# Altium schematic sheet Mach cau H - Phuc.SchDoc: Mach Cau H
size A4; Organization: Altium Limited; Address1: L3, 12a Rodborough Rd; Address2: Frenchs Forest; Address3: NSW; Address4: Australia 2086
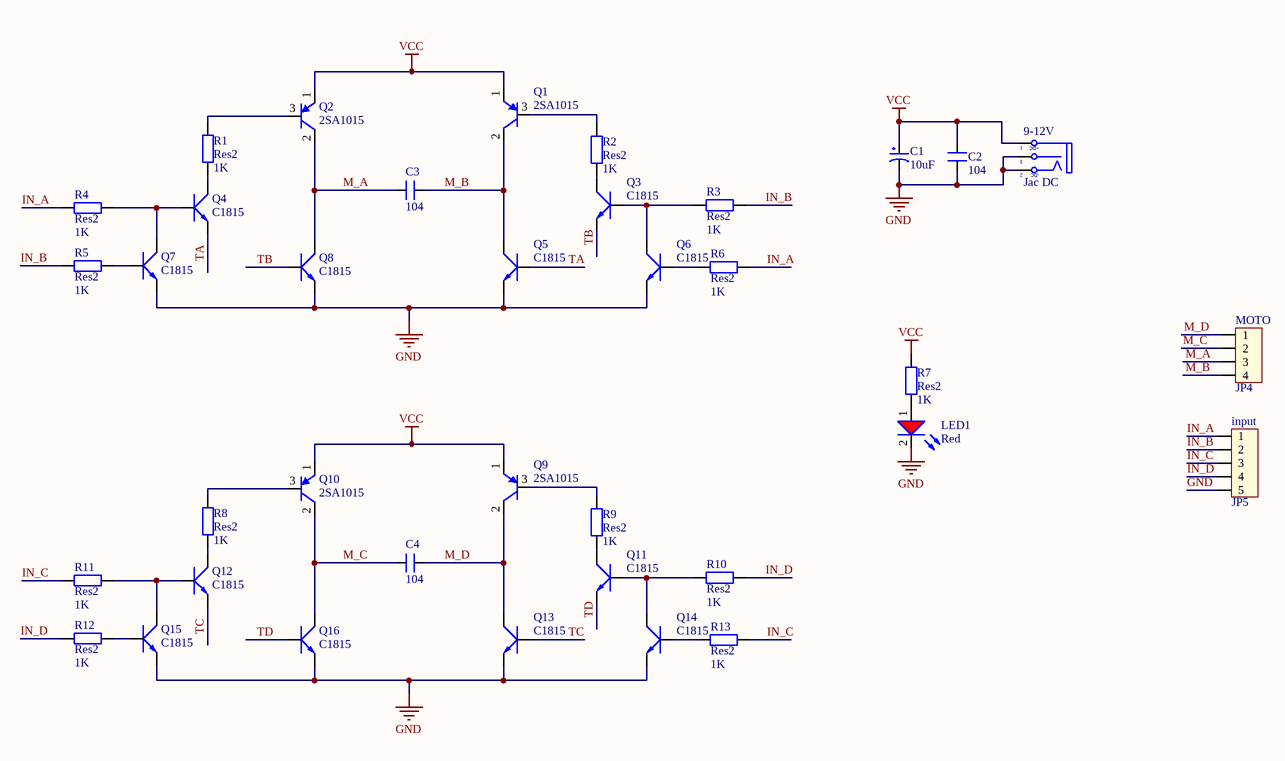
[diagram p0: Mach cau H - Phuc.SchDoc]

## Parts
9-12V  Jac DC  [DC-IN]
C1  10uF  [CP1/2]
C2  104  [CN2]
C3  104  [CN2]
C4  104  [CN2]
input  JP5  [JP5]
LED1  value Red  [LED3R]  (hidden comment: LT0668)
MOTO  JP4  [DOMINO-MKDS-4-PIN]
Q1  2SA1015  [QTO-220]
Q2  2SA1015  [QTO-220]
Q3  C1815  [QTO-92]
Q4  C1815  [QTO-92]
Q5  C1815  [QTO-220]
Q6  C1815  [QTO-92]
Q7  C1815  [QTO-92]
Q8  C1815  [QTO-220]
Q9  2SA1015  [QTO-220]
Q10  2SA1015  [QTO-220]
Q11  C1815  [QTO-92]
Q12  C1815  [QTO-92]
Q13  C1815  [QTO-220]
Q14  C1815  [QTO-92]
Q15  C1815  [QTO-92]
Q16  C1815  [QTO-220]
R1  Res2  value 1K  [RES 1/4W CFR25]
R2  Res2  value 1K  [RES 1/4W CFR25]
R3  Res2  value 1K  [RES 1/4W CFR25]
R4  Res2  value 1K  [RES 1/4W CFR25]
R5  Res2  value 1K  [RES 1/4W CFR25]
R6  Res2  value 1K  [RES 1/4W CFR25]
R7  Res2  value 1K  [RES 1/4W CFR25]
R8  Res2  value 1K  [RES 1/4W CFR25]
R9  Res2  value 1K  [RES 1/4W CFR25]
R10  Res2  value 1K  [RES 1/4W CFR25]
R11  Res2  value 1K  [RES 1/4W CFR25]
R12  Res2  value 1K  [RES 1/4W CFR25]
R13  Res2  value 1K  [RES 1/4W CFR25]

## Nets
GND: 9-12V.2(TN) 9-12V.3(S) C1.2 C2.1 input.5 LED1.2(K) Q5.1(E) Q6.1(E) Q7.1(E) Q8.1(E) Q13.1(E) Q14.1(E) Q15.1(E) Q16.1(E)
VCC: 9-12V.1(T) C1.1 C2.2 Q1.1(E) Q2.1(E) Q9.1(E) Q10.1(E) R7.2
IN_A: input.1 R4.2 R6.2
IN_B: input.2 R3.2 R5.1
IN_C: input.3 R11.2 R13.2
IN_D: input.4 R10.2 R12.1
M_A: C3.1 MOTO.3 Q2.2(C) Q8.2(C)
M_B: C3.2 MOTO.4 Q1.2(C) Q5.2(C)
M_C: C4.1 MOTO.2 Q10.2(C) Q16.2(C)
M_D: C4.2 MOTO.1 Q9.2(C) Q13.2(C)
TA: Q4.1(E) Q5.3(B)
TB: Q3.1(E) Q8.3(B)
TC: Q12.1(E) Q13.3(B)
TD: Q11.1(E) Q16.3(B)
NetLED1_1: LED1.1(A) R7.1
NetQ1_3: Q1.3(B) R2.2
NetQ2_3: Q2.3(B) R1.2
NetQ3_2: Q3.2(C) R2.1
NetQ3_3: Q3.3(B) Q6.2(C) R3.1
NetQ4_2: Q4.2(C) R1.1
NetQ4_3: Q4.3(B) Q7.2(C) R4.1
NetQ6_3: Q6.3(B) R6.1
NetQ7_3: Q7.3(B) R5.2
NetQ9_3: Q9.3(B) R9.2
NetQ10_3: Q10.3(B) R8.2
NetQ11_2: Q11.2(C) R9.1
NetQ11_3: Q11.3(B) Q14.2(C) R10.1
NetQ12_2: Q12.2(C) R8.1
NetQ12_3: Q12.3(B) Q15.2(C) R11.1
NetQ14_3: Q14.3(B) R13.1
NetQ15_3: Q15.3(B) R12.2

## Notes on the sheet
- Title
- Size:
- Date:
- A4
- Number:
- Time:
- Revision:
- Sheet
- of
- File:
- (in symbol DCIN) +DC; -DC

## Library data of the parts
9-12V = DCIN: Jac DC input; Value: Jac DC
C1 = CP1: Cap P  0,1uF < 22uF , 16 - 50V; Value: 10uF/50V; Description 1: 10 => 220uF/6,3V/10V - 10uF => 100uF/16V; Description 2: 0,1uF => 33uF/50V - 10uF => 22uF/63V; Description 3: 0,47uF => 10uF/100V
C2-C4 = CN2: Cap np 104 => 105pF; Value: 0.1uF
input = Con5: Connector 5; Value: Connector 5
LED1 = LT0668: LED Red 2mA 2.0V 3mm; ComponentLink1Description: Datasheet; ComponentLink1URL: D:\Dropbox\Datasheets\Opto and Illumination\LEDs\LT0668.pdf; Unit Price: 0.0067
MOTO = Con4: Connector 4; Value: Connector 4
Q1 Q2 Q9 Q10 = 2SA1015: Trans PNP -50V -150mA TO-92; ComponentLink1Description: Datasheet; ComponentLink1URL: D:\Dropbox\Datasheets\Transistors\N Channel Bipolar\2SA1015.pdf; Unit Price: 0.0143
Q3-Q8 Q11-Q16 = C1815: NPN 600mW, ECB; Value: C1815
R1-R13 = Res2: Resistor; Published: 8-Jun-2000; LatestRevisionDate: 17-Jul-2002; LatestRevisionNote: Re-released for DXP Platform.; PackageReference: AXIAL-0.4; Publisher: Altium Limited; PackageDescription: Axial Device, Thru-Hole; 2 Leads; 0.4 in Pin Spacing